# EAGLE design TB6612FNG (EAGLE 6.5.0)
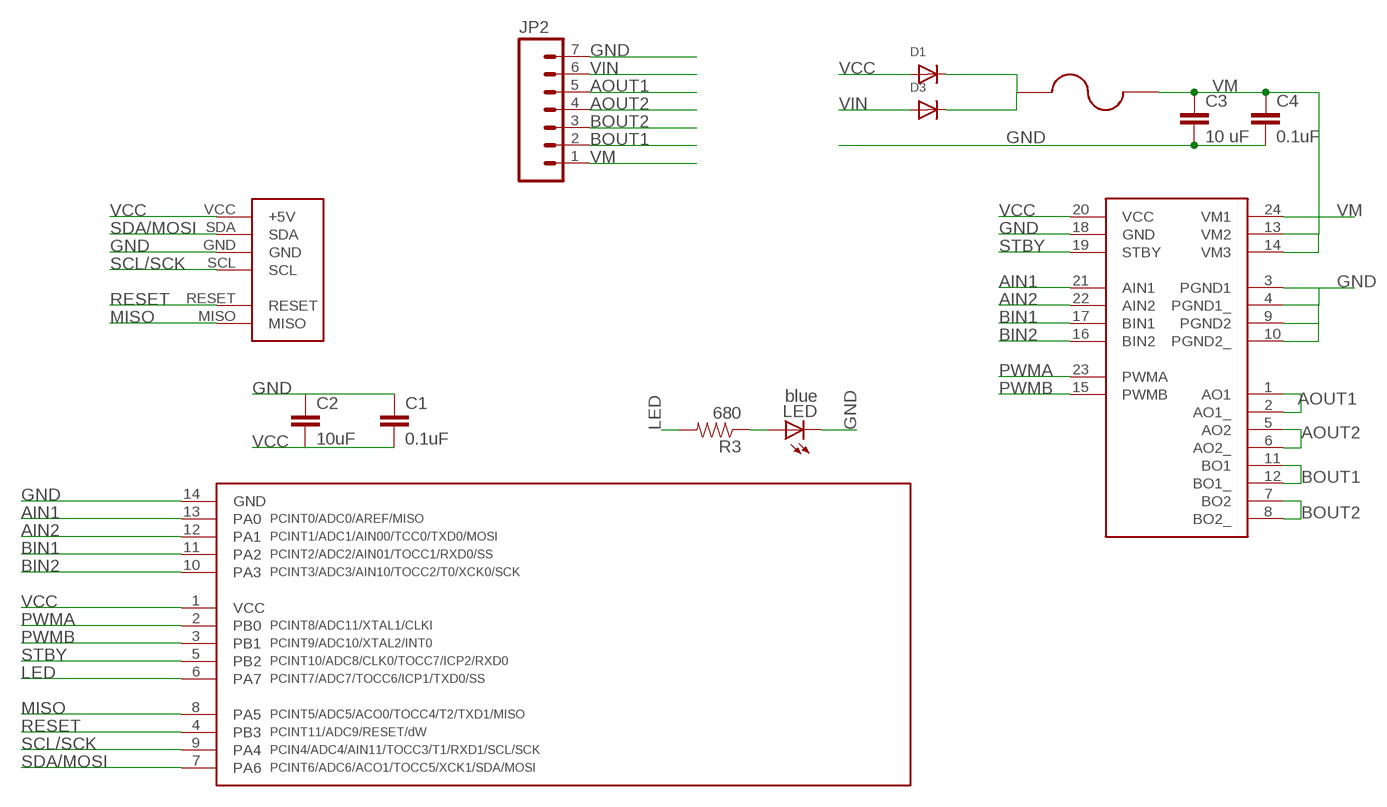
[diagram p0: schematic, sheet 1]

## Parts
C1  0.1uF  CAP0805  [0805]
C2  10uF  CAP0805  [0805]
C3  10 uF  CAP0805  [0805]
C4  0.1uF  CAP0805  [0805]
D1  DIODESOD-123  [SOD-123]
D3  DIODESOD-123  [SOD-123]
JP2  M07  [1X07]
LED  blue  LEDCHIPLED_1206  [CHIPLED_1206]
R3  680  RESISTOR0805-RES  [0805]
U$1  TB6612FNG  [SSOP-24]
U$2  FUSE  [1812]
U$3  TINY841  [SOIC14]
U$4  FOOTPRINTFOOTPRINT-2  [FOOTPRINT2]

## Nets
AIN1: U$1.21(AIN1) U$3.13(PA0)
AIN2: U$1.22(AIN2) U$3.12(PA1)
AOUT1: JP2.5 U$1.1(AO1) U$1.2(AO1_)
AOUT2: JP2.4 U$1.5(AO2) U$1.6(AO2_)
BIN1: U$1.17(BIN1) U$3.11(PA2)
BIN2: U$1.16(BIN2) U$3.10(PA3)
BOUT1: JP2.2 U$1.11(BO1) U$1.12(BO1_)
BOUT2: JP2.3 U$1.7(BO2) U$1.8(BO2_)
GND: C1.1 C2.1 C3.2 C4.2 JP2.7 LED.C U$1.3(PGND1) U$1.4(PGND1_) U$1.9(PGND2) U$1.10(PGND2_) U$1.18(GND) U$3.14(GND) U$4.GND
LED: R3.2 U$3.6(PA7)
MISO: U$3.8(PA5) U$4.MISO
N$1: D1.C D3.C U$2.P$1
N$5: LED.A R3.1
PWMA: U$1.23(PWMA) U$3.2(PB0)
PWMB: U$1.15(PWMB) U$3.3(PB1)
RESET: U$3.4(PB3) U$4.RESET
SCL/SCK: U$3.9(PA4) U$4.SCL
SDA/MOSI: U$3.7(PA6) U$4.SDA
STBY: U$1.19(STBY) U$3.5(PB2)
VCC: C1.2 C2.2 D1.A U$1.20(VCC) U$3.1(VCC) U$4.VCC(+5V)
VIN: D3.A JP2.6
VM: C3.1 C4.1 JP2.1 U$1.13(VM2) U$1.14(VM3) U$1.24(VM1) U$2.P$2

## Library data of the parts
C1-C4 = SparkFun-Capacitors:CAP: Capacitor Standard 0603 ceramic capacitor, and 0.1" leaded capacitor.
D1 D3 = adafruit:DIODE: Diode SMADIODE - SMA Surface Mount Package 20V 1A Schottky Diode Digikey: 641-1014-6-ND DO-1N4148 - Through Hole Small Current Diode SOD-123 20V 1 A (.5mV Vf) Schottky Diode - Digikey: MBRX120TPMSCT-ND SOD-323 10V 570mA (.38mV Vf, 3ns) Schottky Diode - Digikey: ZLLS410CT-ND SOD-523 30V 30mA Schottky Diode (RB751S-40TE61) - Digikey: RB751S-40TE61CT-ND SOT23-R/W - SOT23 Package (R = Solder Paste/Reflow Ovens, W = Hand-Soldering) BAT54Film 40V 300mA - Digikey: 497-7162-1-ND
JP2 = SparkFun-Connectors:M07: Header 7 Standard 7-pin 0.1" header. Use with straight break away headers (SKU : PRT-00116), right angle break away headers (PRT-00553), swiss pins (PRT-00743), machine pins (PRT-00117), and female headers (PRT-00115). NOTES ON THE VARIANTS LOCK and LOCK_LONGPADS... This footprint was designed to help hold the alignment of a through-hole component (i.e. 7-pin header) while soldering it into place. You may notice that each hole has been shifted either up or down by 0.005 of an inch from it's more standard position (which is usually a perfectly straight line). This slight alteration caused the pins (the squares in the middle) to touch the edges of the holes. Because they are alternating, it causes a "brace" to hold the header in place. 0.005 has proven to be the perfect amount of "off-center" position when using our standard breakaway headers. Although looks a little odd when you look at the bare footprint, once you have a header in there, the alteration is very hard to notice. Also, if you push a header all the way into place, it is covered up entirely on the bottom side. This idea of altering the position of holes to aid alignment will be further integrated into the Sparkfun Library for other footprints. It can help hold any component with 3 or more connection pins.
LED = led:LED: LED OSRAM: - CHIPLED LG R971, LG N971, LY N971, LG Q971, LY Q971, LO R971, LY R971 LH N974, LH R974 LS Q976, LO Q976, LY Q976 LO Q996 - Hyper CHIPLED LW Q18S LB Q993, LB Q99A, LB R99A - SideLED LS A670, LO A670, LY A670, LG A670, LP A670 LB A673, LV A673, LT A673, LW A673 LH A674 LY A675 LS A676, LA A676, LO A676, LY A676, LW A676 LS A679, LY A679, LG A679 - Hyper Micro SIDELED® LS Y876, LA Y876, LO Y876, LY Y876 LT Y87S - SmartLED LW L88C, LW L88S LB L89C, LB L89S, LG L890 LS L89K, LO L89K, LY L89K LS L896, LA L896, LO L896, LY L896 - TOPLED LS T670, LO T670, LY T670, LG T670, LP T670 LSG T670, LSP T670, LSY T670, LOP T670, LYG T670 LG T671, LOG T671, LSG T671 LB T673, LV T673, LT T673, LW T673 LH T674 LS T676, LA T676, LO T676, LY T676, LB T676, LH T676, LSB T676, LW T676 LB T67C, LV T67C, LT T67C, LS T67K, LO T67K, LY T67K, LW E67C LS E67B, LA E67B, LO E67B, LY E67B, LB E67C, LV E67C, LT E67C LW T67C LS T679, LY T679, LG T679 LS T770, LO T770, LY T770, LG T770, LP T770 LB T773, LV T773, LT T773, LW T773 LH T774 LS E675, LA E675, LY E675, LS T675 LS T776, LA T776, LO T776, LY T776, LB T776 LHGB T686 LT T68C, LB T68C - Hyper Mini TOPLED® LB M676 - Mini TOPLED Santana® LG M470 LS M47K, LO M47K, LY M47K Source: http://www.osram.convergy.de LUXEON: - LUMILED® LXK2-PW12-R00, LXK2-PW12-S00, LXK2-PW14-U00, LXK2-PW14-V00 LXK2-PM12-R00, LXK2-PM12-S00, LXK2-PM14-U00 LXK2-PE12-Q00, LXK2-PE12-R00, LXK2-PE12-S00, LXK2-PE14-T00, LXK2-PE14-U00 LXK2-PB12-K00, LXK2-PB12-L00, LXK2-PB12-M00, LXK2-PB14-N00, LXK2-PB14-P00, LXK2-PB14-Q00 LXK2-PR12-L00, LXK2-PR12-M00, LXK2-PR14-Q00, LXK2-PR14-R00 LXK2-PD12-Q00, LXK2-PD12-R00, LXK2-PD12-S00 LXK2-PH12-R00, LXK2-PH12-S00 LXK2-PL12-P00, LXK2-PL12-Q00, LXK2-PL12-R00 Source: www.luxeon.com KINGBRIGHT: KA-3528ASYC Source: www.kingbright.com
R3 = SparkFun-Passives:RESISTOR: Resistor Basic schematic elements and footprints for 0603, 1206, and PTH resistors.
U$1 = IntegerLabs:TB6612FNG
U$2 = IntegerLabs:FUSE
U$3 = IntegerLabs:TINY841
U$4 = IntegerLabs:FOOTPRINT

## Board
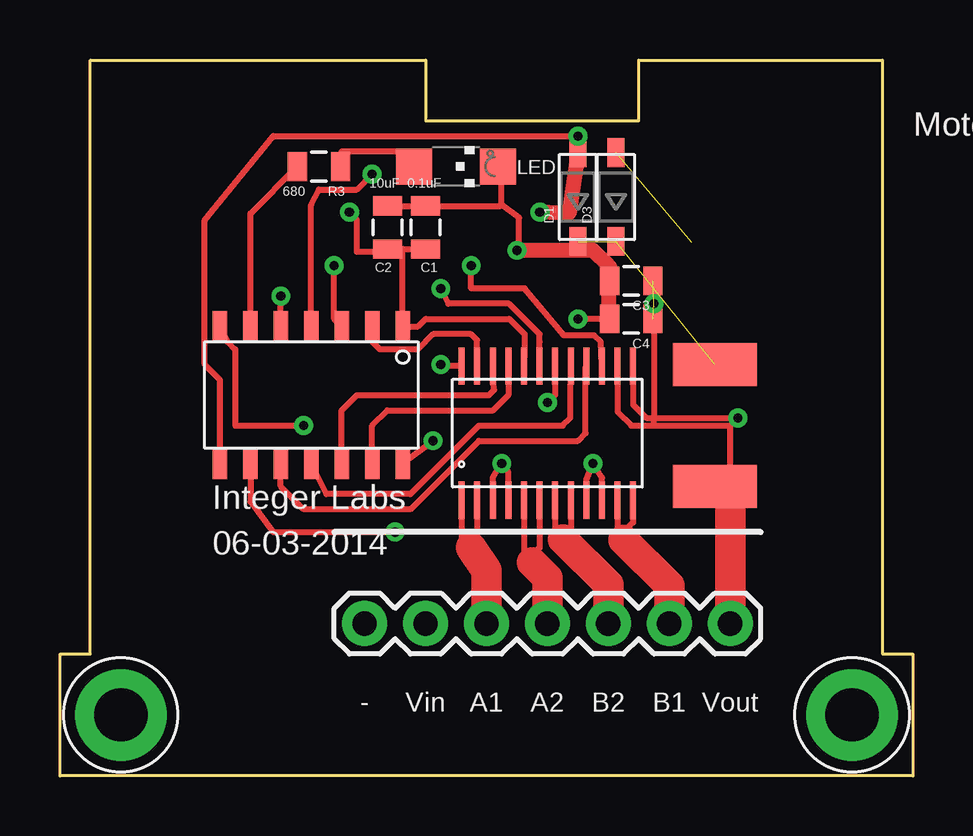
[diagram p1: board, top side]
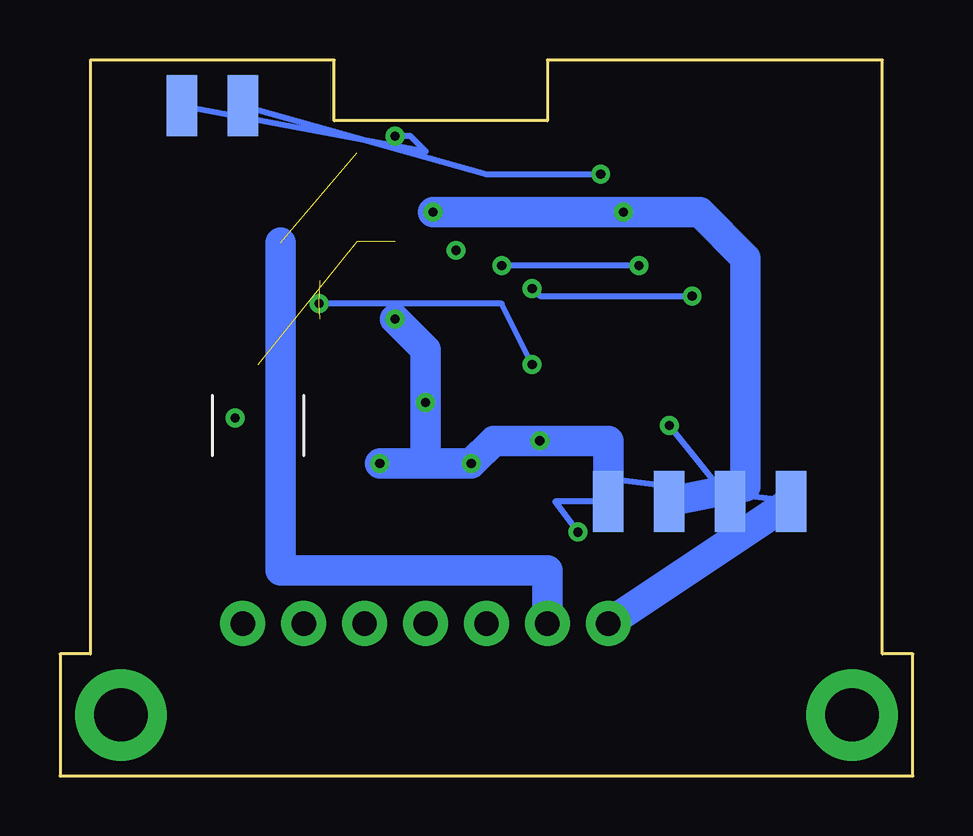
[diagram p2: board, bottom side, seen from below]

Size 35.56 x 29.84 mm. Coordinates in mm from the lower left corner, seen from the top.
Copper layers (1*16): Top 0.0178mm / dielectric 59mil / Bottom 0.0178mm
Design rules "SSC-EAGLE-2Lyr_v1.0.0.3": minimum track width 6mil, minimum drill 14mil, track to track 6mil, track to pad 6mil, pad to pad 6mil, via to via 6mil, smd to smd 6mil, copper to edge 20mil, drill to drill 16mil, minimum pad ring 8mil, minimum via ring 8mil, stop-mask expansion 3mil, vias tented up to drill 0mil, thermal gap 10mil

### Footprints (pad centres in the part's own frame; a part is rotated, then mirrored left to right if it is on the bottom)
0805 = smd 0.8 x 1.2: 1 -0.9,0; 2 0.9,0
SOD-123 = smd 1.2 x 0.7: A 1.85,0; C -1.85,0
1X07 = drill 1.016 pad 1.88: 1 0,0; 2 2.54,0; 3 5.08,0; 4 7.62,0; 5 10.16,0; 6 12.7,0; 7 15.24,0
CHIPLED_1206 = smd 1.5 x 1.5: A 0,-1.75; C 0,1.75
SSOP-24 = smd 0.25 x 1.55: 1 -3.575,-2.8; 2 -2.925,-2.8; 3 -2.275,-2.8; 4 -1.625,-2.8; 5 -0.975,-2.8; 6 -0.325,-2.8; 7 0.325,-2.8; 8 0.975,-2.8; 9 1.625,-2.8; 10 2.275,-2.8; 11 2.925,-2.8; 12 3.575,-2.8; 13 3.575,2.8; 14 2.925,2.8; 15 2.275,2.8; 16 1.625,2.8; 17 0.975,2.8; 18 0.325,2.8; 19 -0.325,2.8; 20 -0.975,2.8; 21 -1.625,2.8; 22 -2.275,2.8; 23 -2.925,2.8; 24 -3.575,2.8
1812 = smd 1.778 x 3.505: P$1 -2.54,0; P$2 2.54,0
SOIC14 = smd 0.61 x 1.27: 1 0,-3.175; 2 1.27,-3.175; 3 2.54,-3.175; 4 3.81,-3.175; 5 5.08,-3.175; 6 6.35,-3.175; 7 7.62,-3.175; 8 7.62,2.54; 9 6.35,2.54; 10 5.08,2.54; 11 3.81,2.54; 12 2.54,2.54; 13 1.27,2.54; 14 0,2.54
FOOTPRINT2 = smd 1.27 x 2.54 bottom: GND 5.08,11.43; MISO 30.48,27.94; RESET 27.94,27.94; SCL 12.7,11.43; SDA 7.62,11.43; VCC 10.16,11.43 | drill 2.223 pad 3.81: P$1 2.54,2.54; P$2 33.02,2.54

### Placement (x,y rotation side)
C1  15.24,22.86 270 top
C2  13.65,22.86 270 top
C3  23.81,20.64 180 top
C4  23.81,19.05 180 top
D1  21.59,24.13 90 top
D3  23.18,24.13 90 top
JP2  27.94,6.35 180 top
LED  16.51,25.4 270 top
R3  10.8,25.4 180 top
U$1  20.32,14.29 0 top
U$2  27.3,14.61 270 top
U$3  14.29,15.56 180 top
U$4  0,0 0 top

### Tracks (layer width: path | path; a pad name or v marks a point on that pad's centre or on a via)
AIN1
  Top 0.254: U$1.21 18.7,15.88 18.06,15.24 13.65,15.24 13.02,14.61 U$3.13
AIN2
  Top 0.254: U$1.22 18.05,16.77 18.1,16.09 17.89,15.88 12.38,15.88 11.75,15.24 U$3.12
AOUT1
  Top 0.254: U$1.1 16.75,9.93 16.99,9.68 | 16.99,9.68 17.14,9.53 | U$1.2 17.39,10.09 16.99,9.68
  Top 1.27: JP2.5 17.78,8.57 17.14,9.53
AOUT2
  Top 0.254: U$1.5 19.35,9.23 19.53,9.05 | 19.53,9.05 19.69,8.89 | U$1.6 20,9.52 19.53,9.05
  Top 1.27: JP2.4 20.32,8.25 19.69,8.89
BIN1
  Top 0.254: U$1.17 21.3,16.53 21.27,16.19 21.27,14.92 20.96,14.61 17.46,14.61 14.61,11.75 11.11,11.75 U$3.11
BIN2
  Top 0.254: U$3.10 9.21,12.07 10.16,11.11 14.61,11.11 17.46,13.97 21.59,13.97 21.91,14.29 21.91,17.05 U$1.16
BOUT1
  Top 0.254: U$1.11 23.25,10.09 23.34,10 | 23.34,10 23.5,9.84 | U$1.12 23.89,10.56 23.34,10
  Top 1.27: JP2.2 25.4,7.94 23.5,9.84
BOUT2
  Top 0.254: U$1.7 20.64,10.2 20.98,9.87 21.27,9.84 21.3,9.87 U$1.8
  Top 1.27: JP2.3 22.86,7.98 20.98,9.87
GND  (via drill 0.38)
  Top 0.254: U$3.14 v15.56,13.97 | 18.41,23.81 19.14,23.27 19.14,21.96 19,21.96 v19.05,21.91 | 18.41,23.81 18.41,25.24 LED.C | U$1.9 21.95,12.34 v22.23,13.02 22.6,12.43 U$1.10 | U$1.4 18.7,12.66 v18.41,13.02 18.05,12.43 U$1.3 | C2.1 C1.1 18.36,23.76 18.41,23.81 | U$1.18 20.64,15.88 v20.32,15.56 | C4.2 v21.59,19.05
  Top 0.635: C4.2 22.86,21.27 | 22.86,21.27 22.23,21.91 v19.05,21.91 | C3.2 22.91,21.22 22.86,21.27
  Bottom 0.254: U$4.GND 12.7,12.38
  Bottom 1.27: 20.32,13.02 v18.41,13.02 17.46,13.97 v15.56,13.97 12.7,13.97 12.7,12.38 | 20.32,13.02 v22.23,13.02 | JP2.7 U$4.GND | 20.32,13.02 v20.32,15.56 20.32,17.78 v21.59,19.05
LED
  Top 0.254: U$3.6 7.94,23.44 R3.2
MISO  (via drill 0.38)
  Top 0.254: U$3.8 6.67,16.51 6.03,17.14 6.03,23.18 8.89,26.67 v21.59,26.67
  Bottom 0.254: U$4.MISO 20.32,26.04 20.96,26.67 v21.59,26.67
N$1  (2 unrouted)
N$5
  Top 0.254: R3.1 11.75,25.4 11.75,26.04 14.29,26.04 14.29,25.87 LED.A
PWMA
  Top 0.254: U$1.23 17.39,18.16 17.14,18.41 15.56,18.41 14.92,17.78 13.34,17.78 13.02,18.1 U$3.2
PWMB  (via drill 0.38)
  Top 0.254: U$1.15 22.54,18.1 22.28,18.36 21.01,18.36 19.37,20.32 17.14,20.32 v17.14,21.27 | U$3.3 11.43,19.05 v11.43,21.27
  Bottom 0.254: v11.43,21.27 v17.14,21.27
RESET  (via drill 0.38)
  Top 0.254: U$3.4 10.48,23.81 10.8,24.45 12.38,24.45 v13.02,25.08
  Bottom 0.254: U$4.RESET 17.78,25.08 v13.02,25.08
SCL/SCK  (via drill 0.38)
  Top 0.254: U$3.9 7.94,11.43 8.89,10.16 v13.97,10.16
  Bottom 0.254: U$4.SCL 14.92,11.43 v13.97,10.16
SDA/MOSI  (via drill 0.38)
  Top 0.254: U$3.7 6.99,18.1 7.3,17.78 7.3,14.61 v10.16,14.61
  Bottom 0.254: U$4.SDA v10.16,14.61
STBY  (via drill 0.38)
  Top 0.254: U$1.19 20,18.11 20,18.41 18.73,19.68 16.19,19.68 v15.88,20.32 | U$3.5 v9.21,20
  Bottom 0.254: v15.88,20.32 15.56,20 v9.21,20
VCC  (via drill 0.38)
  Top 0.254: U$1.20 19.37,17.75 19.37,18.41 18.73,19.05 15.24,19.05 14.92,18.73 U$3.1 14.29,21.96 | 14.29,21.96 C2.2 13.55,21.86 12.38,21.86 12.38,23.18 v12.07,23.49 | 14.29,21.96 C1.2
  Top 0.635: D1.A 21.22,23.44 v20,23.49
  Bottom 1.27: v20,23.49 v12.07,23.49 8.89,23.49 6.99,21.59 6.99,12.07 U$4.VCC
VIN  (1 unrouted)
  Bottom 1.27: 26.35,22.22 26.35,8.57 15.24,8.57 JP2.6
VM  (via drill 0.38)  (2 unrouted)
  Top 0.254: U$1.13 23.89,15.48 24.45,14.92 24.77,14.92 | 24.77,14.92 v28.26,14.92 27.94,14.61 | U$1.14 23.25,15.17 23.81,14.61 24.77,14.61 | 24.77,14.61 27.94,14.61 | U$1.24 16.25,17.09 v15.88,17.14 | v24.77,19.68 24.77,14.92 | 24.77,14.61 24.77,14.92 | 27.94,12.07 27.94,14.61
  Top 1.27: JP2.1 27.94,12.07 U$2.P$2
  Bottom 0.254: v15.88,17.14 17.14,19.68 v24.77,19.68

### Text on the board
tPlace: Motor Driver v1 | Integer Labs | 06-03-2014
tNames: - | Vin | A1 | A2 | B2 | B1 | Vout